# EasyEDA Pro project Control.eprj

# Schematic Schematic1
Board Name: Board1; Create Date: 2024-10-12
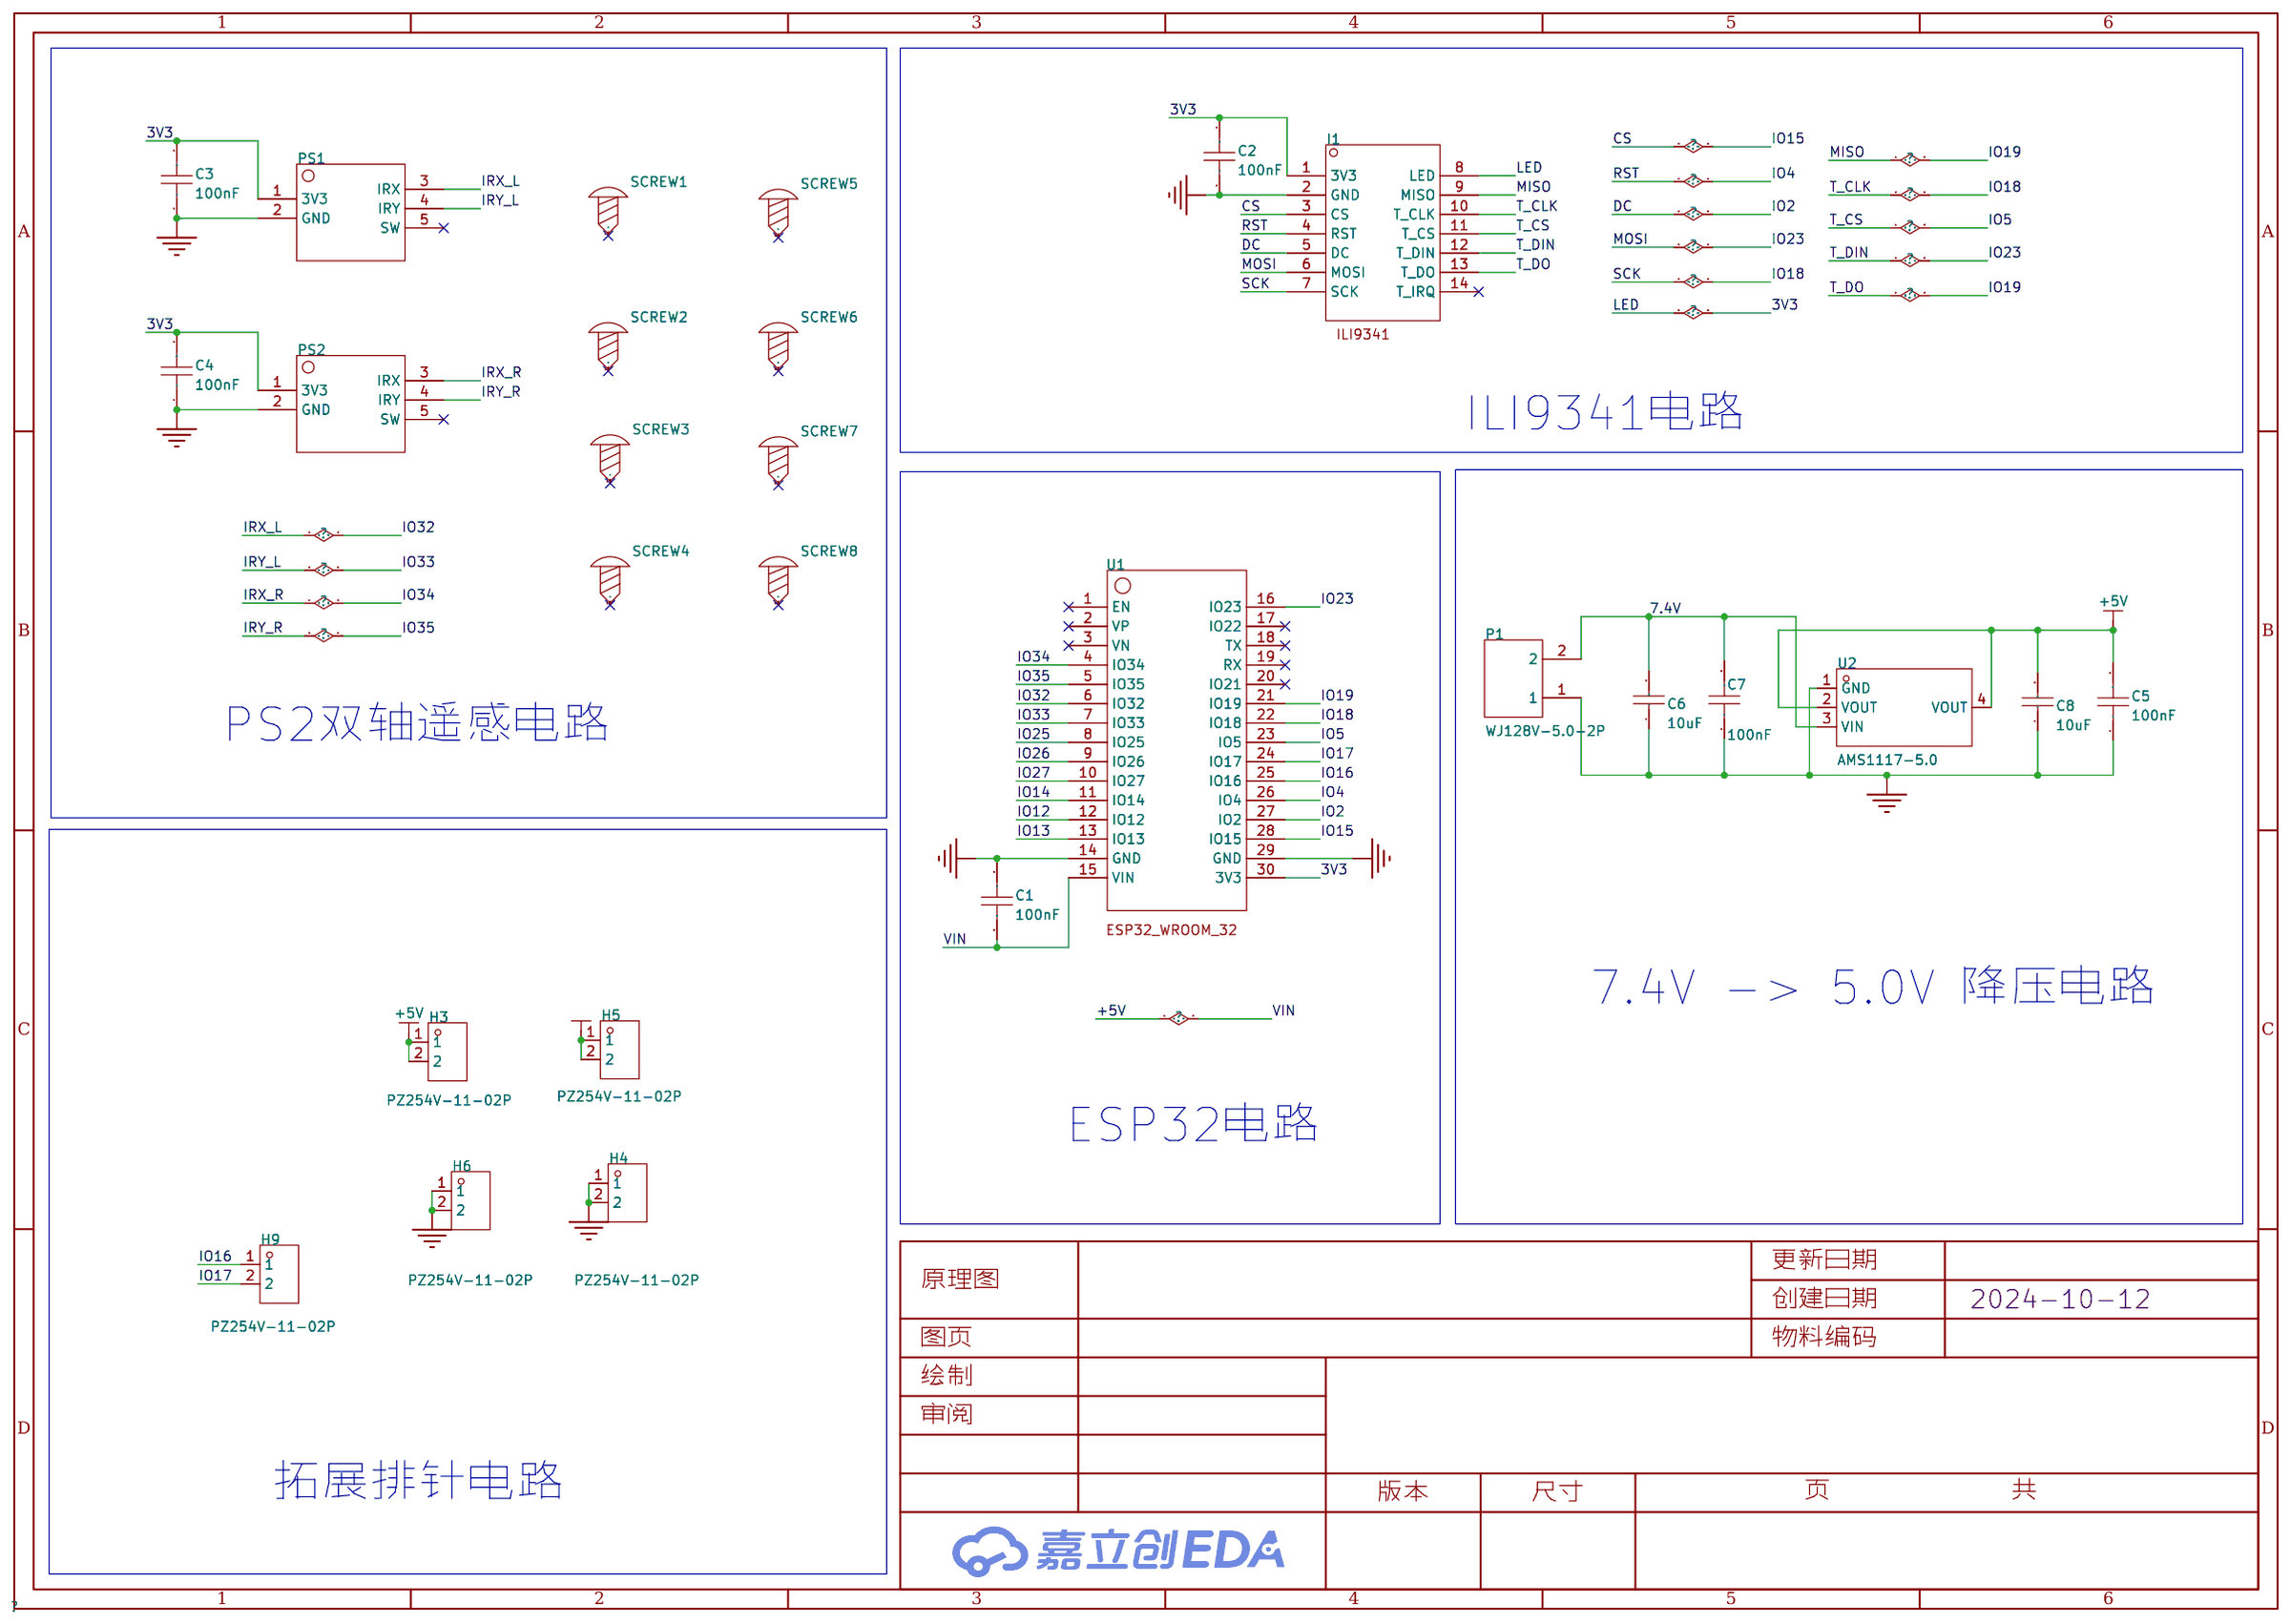
[diagram p0: schematic sheet]

## Parts
C1  100nF  [C0603]
C2  100nF  [C0603]
C3  100nF  [C0603]
C4  100nF  [C0603]
C5  100nF  [C0603]
C6  10uF  [C0805]
C7  100nF  [C0603]
C8  10uF  [C0805]
H3  PZ254V-11-02P  [HDR-TH_2P-P2.54-V-M]
H4  PZ254V-11-02P  [HDR-TH_2P-P2.54-V-M]
H5  PZ254V-11-02P  [HDR-TH_2P-P2.54-V-M]
H6  PZ254V-11-02P  [HDR-TH_2P-P2.54-V-M]
H9  PZ254V-11-02P  [HDR-TH_2P-P2.54-V-M]
I1  -  [ILI9341]
P1  WJ128V-5.0-2P  [CONN-TH_2P-P5.00_WJ128V-5.0-2P]
PS1  -  [PS2]
PS2  -  [PS2]
SCREW1  -  [M2螺丝]
SCREW2  -  [M2螺丝]
SCREW3  -  [M2螺丝]
SCREW4  -  [M2螺丝]
SCREW5  -  [M2螺丝]
SCREW6  -  [M2螺丝]
SCREW7  -  [M2螺丝]
SCREW8  -  [M2螺丝]
U1  -  [ESP32_WROOM_32]
U2  AMS1117-5.0  [SOT-223_L6.5-W3.5-P2.30-LS7.0-BR]

## Library data of the parts
C1-C5 C7 = CGA0603X7R104K500JT: 容值:100nF;精度:±10%;额定电压:50V;材质(温度系数):X7R;; LCSC Part Name: 100nF ±10% 50V; Supplier Part: C6119867; Manufacturer: HRE(芯声); Supplier Footprint: 0603; JLCPCB Part Class: 扩展库; Supplier: LCSC; Tolerance: ±10%; Voltage Rated: 50V; Temperature Coefficient: X7R
C6 C8 = CL21A106KPFNNNE: 容值:10uF;精度:±10%;额定电压:10V;材质(温度系数):X5R;; LCSC Part Name: 10uF ±10% 10V; Supplier Part: C17024; Manufacturer: SAMSUNG(三星); Supplier Footprint: 0805; JLCPCB Part Class: 扩展库; Datasheet: https://atta.szlcsc.com/upload/public/pdf/source/20160218/1457707763339.pdf; Supplier: LCSC; Tolerance: ±10%; Voltage Rated: 10V; Temperature Coefficient: X5R
H3-H6 H9 = PZ254V-11-02P: 插针结构:1x2P;间距:2.54mm;行距:-;圆针/方针:方针;安装类型:直插;排数:单排;总PIN位数:2P;额定电流:-;额定电压:-;配合针长度:6mm;塑高:2.5mm;端接针长度:3mm;触头材质:黄铜;触头镀层:-;工作温度范围:-40℃~+105℃;颜色:黑色;; LCSC Part Name: 间距:2.54mm 1x2P 直插 方针; Supplier Part: C492401; Manufacturer: XFCN(兴飞); Supplier Footprint: 插件,P=2.54mm; Datasheet: https://atta.szlcsc.com/upload/public/pdf/source/20200309/C492401_A812433581A9B211A7FFA413ADDFF0E5.pdf; Supplier: LCSC; Pin Structure: 1x2P; Pitch: 2.54mm; Circluar Pins/Square Pins: 方针; Mounting Type: 直插; Number of Rows: 单排; Number of Pins: 2P; Length of Mating Pin: 6mm; Insulation Height: 2.5mm; Length of End Connection Pin: 3mm; Contact Material: 黄铜; Operating Temperature Range: -40℃~+105℃; Color: 黑色
I1 = ILI9341
P1 = WJ128V-5.0-2P: 结构:1x2P;间距:5mm;颜色:绿色;安装方式:直插;额定电流:20A;额定电压:250V;排数:1;线规 - AWG:12~22;线规 - 平方毫米:2.5;每排PIN数:2;工作温度范围:-40℃~+105℃;; LCSC Part Name: 5mm 1x2P 排数:1 每排P数:2 直插; Supplier Part: C8269; Manufacturer: KANGNEX(康奈克斯电气); Supplier Footprint: 插件,P=5mm; Datasheet: https://atta.szlcsc.com/upload/public/pdf/source/20191225/C8269_1FF44D6D2E83DB14A7CA266A410FD9AD.pdf; Supplier: LCSC; Structure: 1x2P; Pitch: 5mm; Color: 绿色; Mounting Style: 直插; Current Rating (Max): 20A; Voltage Rating (Max): 250V; Number of Pins: 2P; Number of Rows: 1; Wire Gauge - AWG: 12~22; Wire Gauge - mm2: 2.5; Number of PINs Per Row: 2; Operating Temperature Range: -40℃~+105℃
PS1 PS2 = PS2
SCREW1-SCREW8 = M2螺丝: Supplier Footprint: 插件
U1 = ESP32_WROOM_32
U2 = AMS1117-5.0_C6187: 输出类型:固定;最大输入电压:12V;输出电压:5V;最大输出电流:1A;电源纹波抑制比(PSRR):68dB@(120Hz);输出极性:正极;; LCSC Part Name: 输入12V 输出5V 1A; Supplier Part: C6187; Manufacturer: AMS; Supplier Footprint: SOT-223; Datasheet: https://atta.szlcsc.com/upload/public/pdf/source/20230918/E4B716057EE82179D88E8A0894830D59.pdf; Supplier: LCSC; Output Type: 固定; Maximum Input Voltage: 12V; Output Voltage: 5V; MAX Output Current: 1A; Power Supply Rejection Ratio (PSRR): 68dB@(120Hz); Dropout Voltage: 1.3V@(1A); Output Polarity: 正极; Number of Outputs: 1

## Nets
3V3: C2.2 C3.2 C4.2 H5.1 H5.2 I1.1(3V3) I1.8(LED) PS1.1(3V3) PS2.1(3V3) U1.30(3V3)
7.4V: C6.2 C7.2 P1.2 U2.3(VIN)
+5V: C1.1 C5.2 C8.2 H3.1 H3.2 U1.15(VIN) U2.2(VOUT) U2.4(VOUT)
GND: C1.2 C2.1 C3.1 C4.1 C5.1 C6.1 C7.1 C8.1 H4.1 H4.2 H6.1 H6.2 I1.2(GND) P1.1 PS1.2(GND) PS2.2(GND) U1.14(GND) U1.29(GND) U2.1(GND)
CS: I1.3(CS) U1.28(IO15)
DC: I1.5(DC) U1.27(IO2)
IO4: I1.4(RST) U1.26(IO4)
IO5: I1.11(T_CS) U1.23(IO5)
IO12: U1.12(IO12)
IO13: U1.13(IO13)
IO14: U1.11(IO14)
IO16: H9.1 U1.25(IO16)
IO17: H9.2 U1.24(IO17)
IO18: I1.7(SCK) I1.10(T_CLK) U1.22(IO18)
IO19: I1.9(MISO) I1.13(T_DO) U1.21(IO19)
IO23: I1.6(MOSI) I1.12(T_DIN) U1.16(IO23)
IO25: U1.8(IO25)
IO26: U1.9(IO26)
IO27: U1.10(IO27)
IO32: PS1.3(IRX) U1.6(IO32)
IO33: PS1.4(IRY) U1.7(IO33)
IO34: PS2.3(IRX) U1.4(IO34)
IO35: PS2.4(IRY) U1.5(IO35)

Not connected (* = marked no-connect by the designer): I1 14(T_IRQ)*; PS1 5(SW)*; PS2 5(SW)*; SCREW1 1*; SCREW2 1*; SCREW3 1*; SCREW4 1*; SCREW5 1*; SCREW6 1*; SCREW7 1*; SCREW8 1*; U1 1(EN)* 2(VP)* 3(VN)* 17(IO22)* 18(TX)* 19(RX)* 20(IO21)*

## Notes on the sheet
- ILI9341电路
- PS2双轴遥感电路
- 7.4V -> 5.0V 降压电路
- ESP32电路
- 拓展排针电路

# Board PCB1
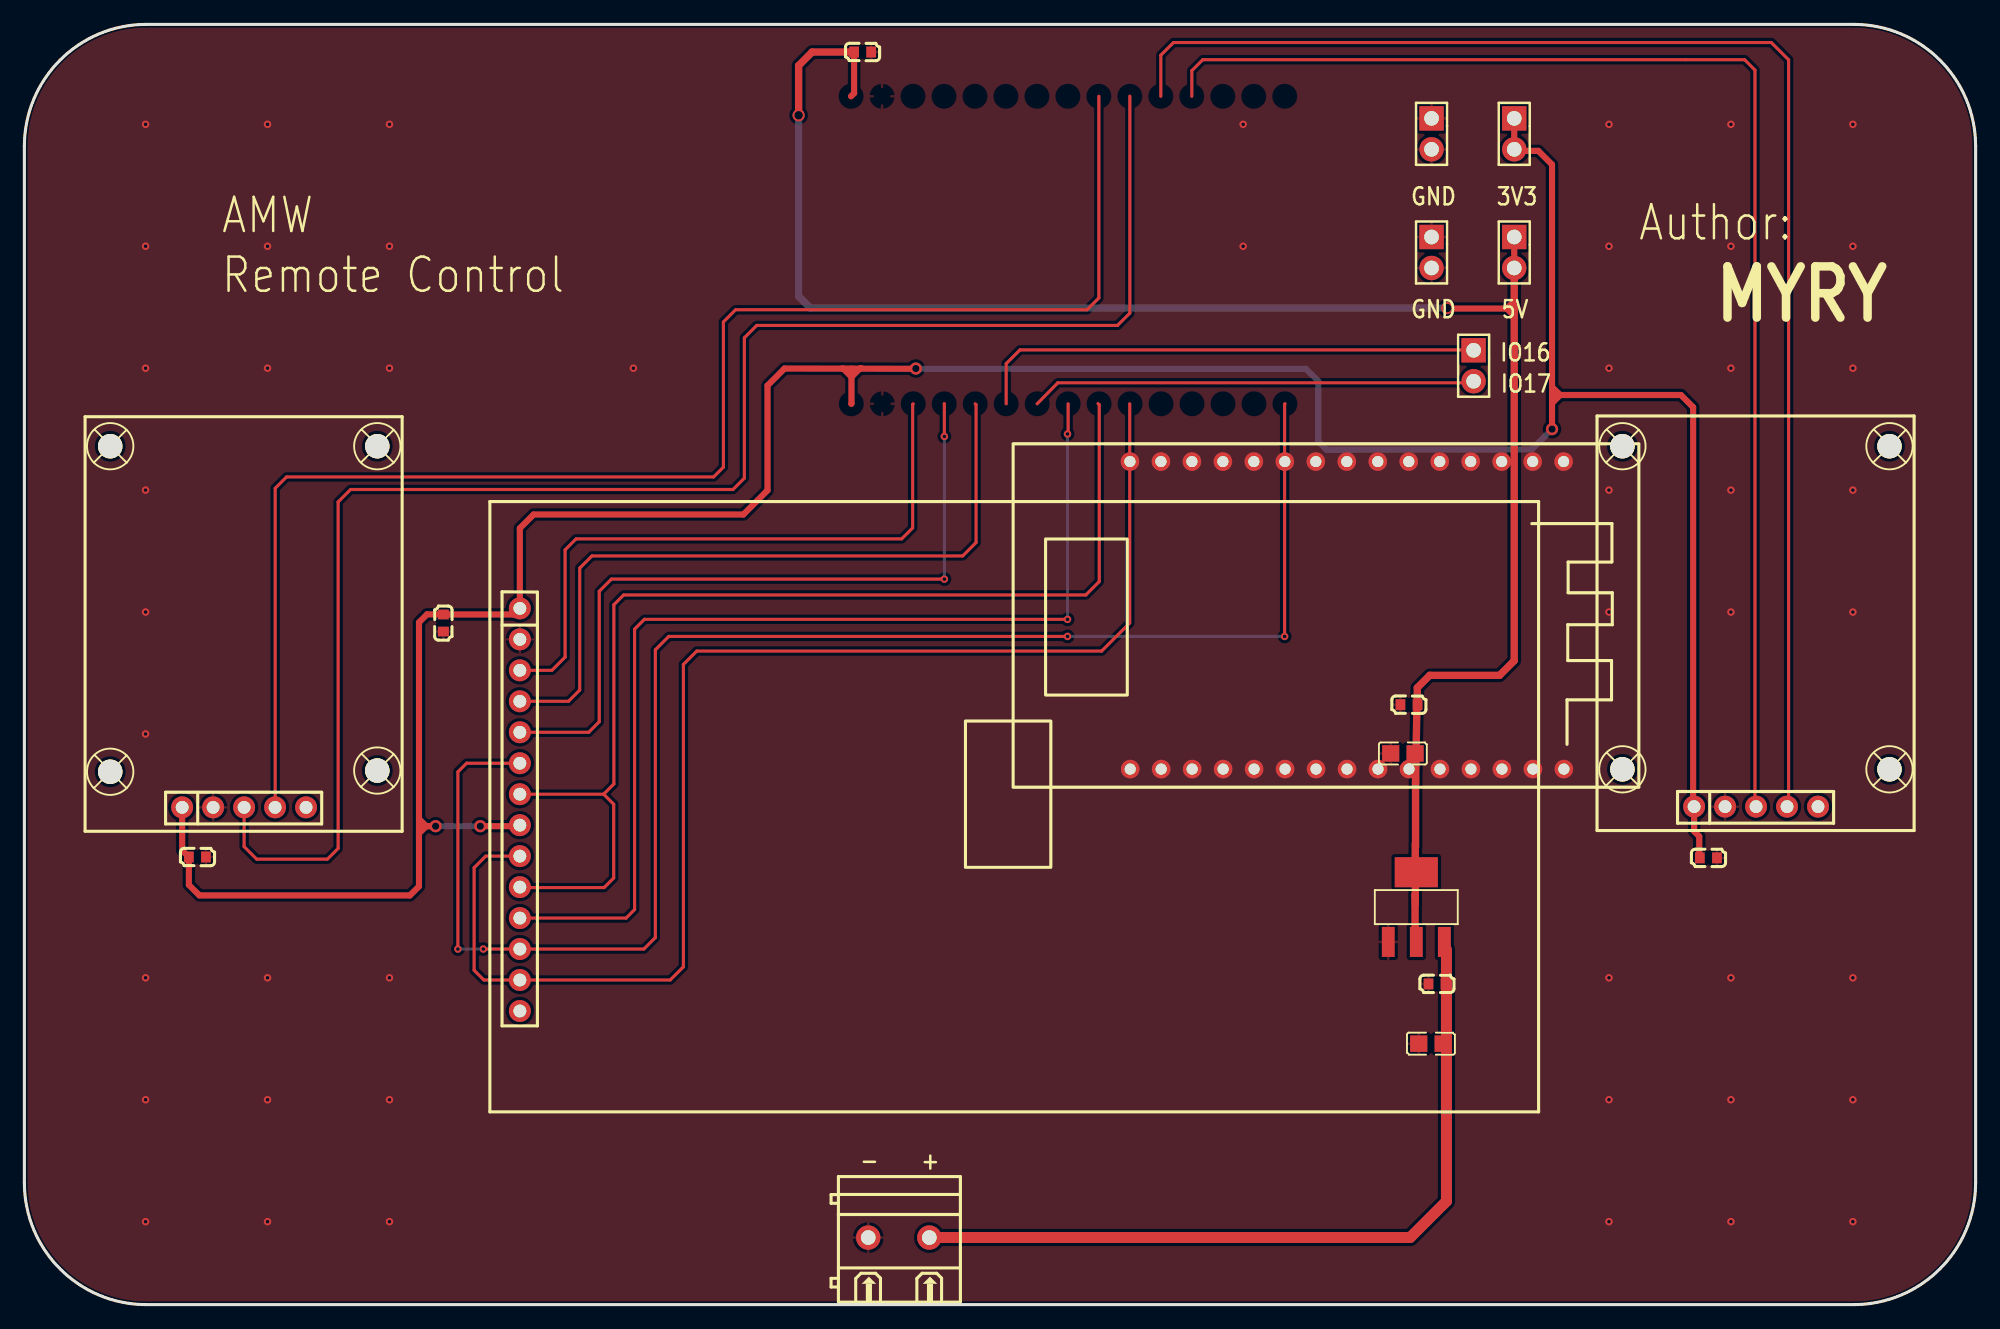
[diagram p1: board, top side]
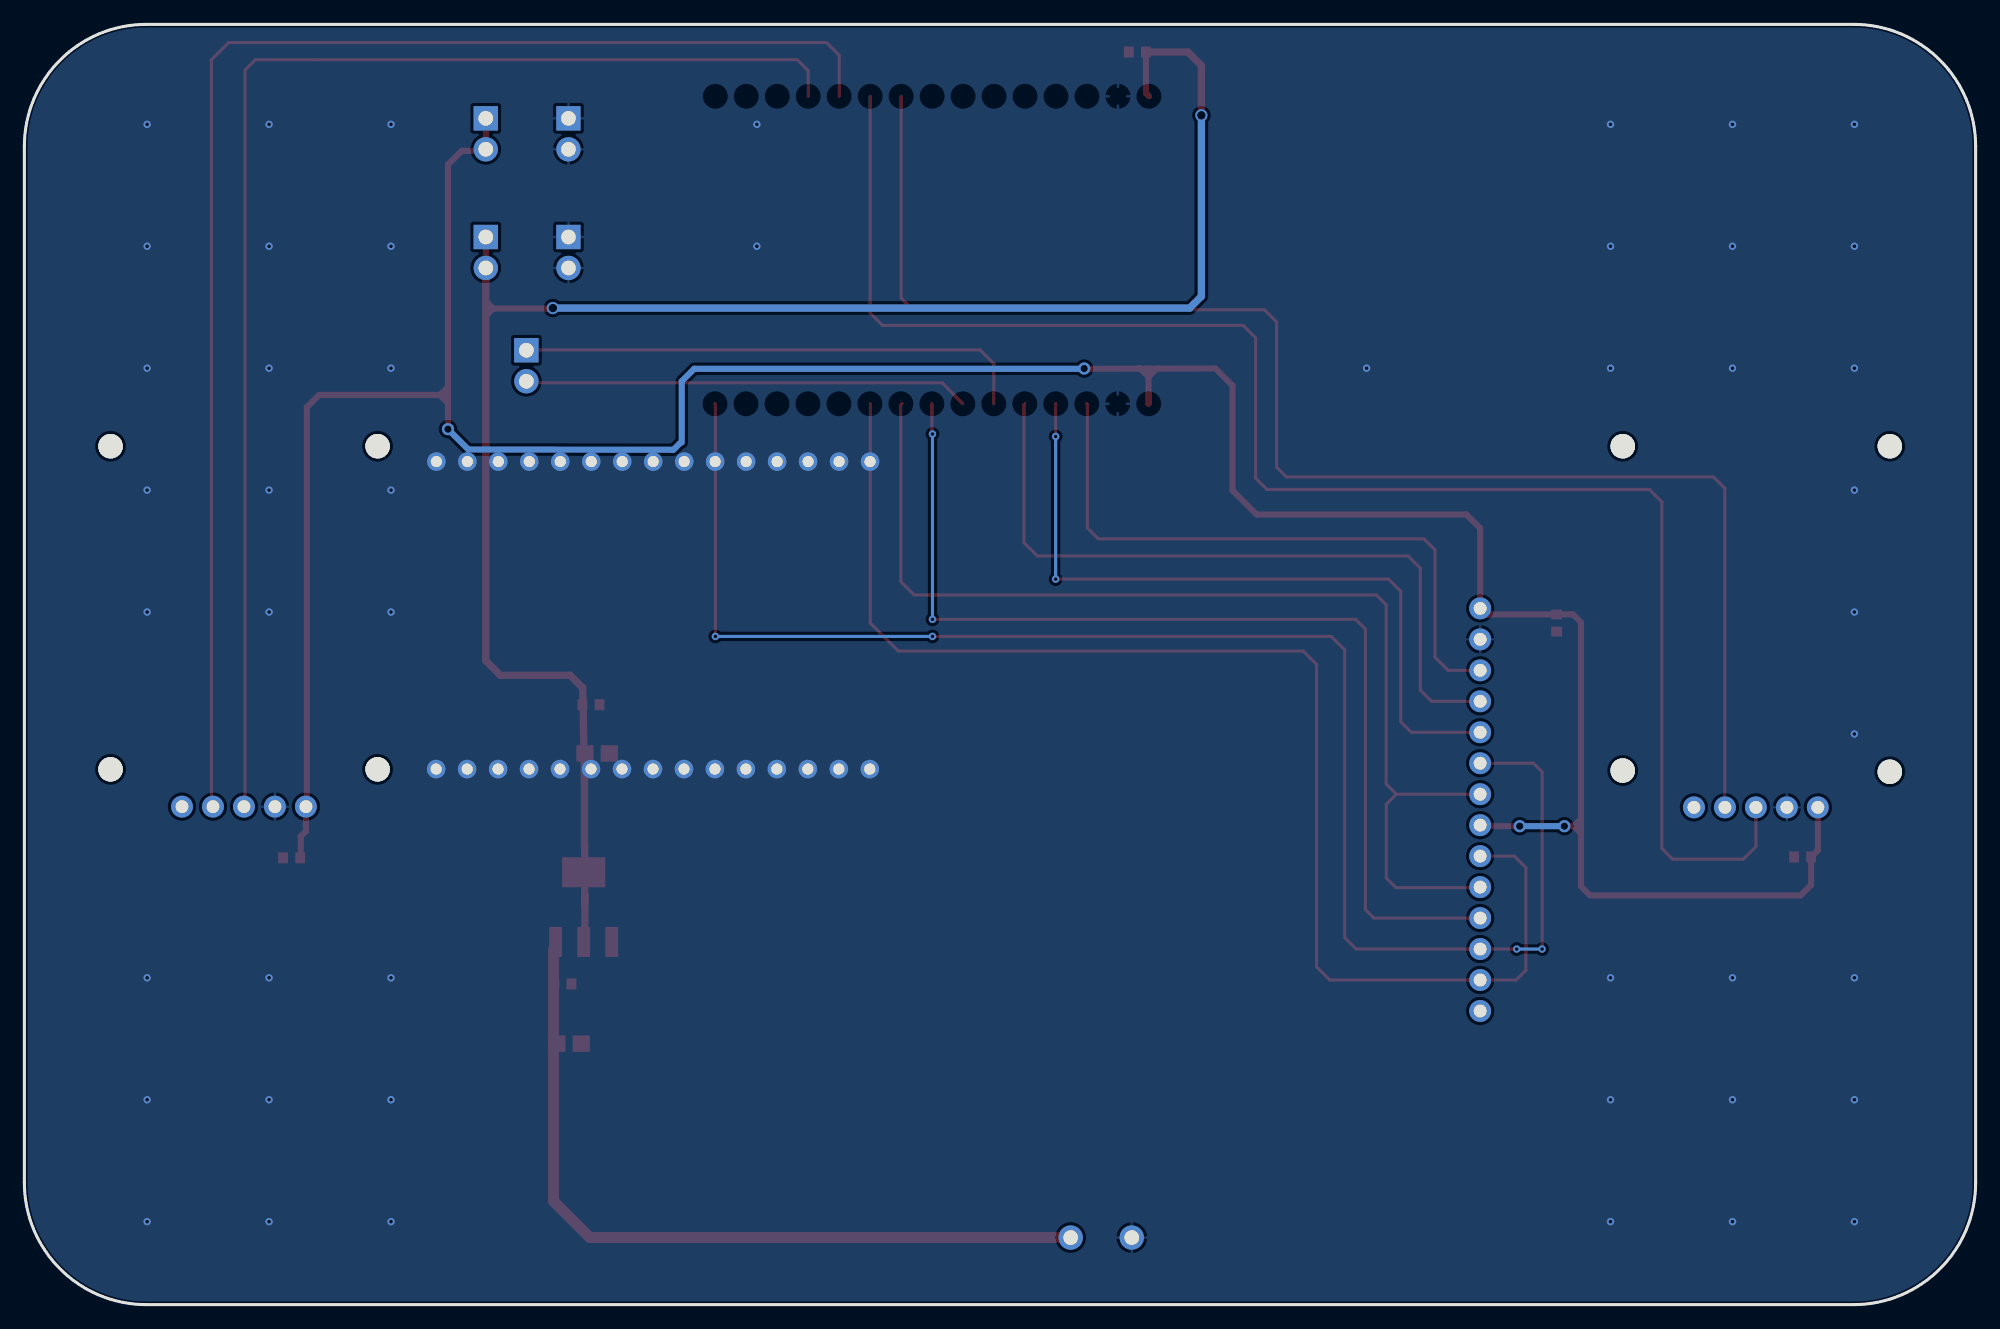
[diagram p2: board, bottom side, seen from below]

Outline 160 x 105 mm; copper layers: Top Layer, Bottom Layer. Coordinates in mm from the lower left corner of the outline.
Outline path: 0,95 0,10 arc(2.93,2.93) 10,0 150,0 arc(157.07,2.93) 160,10 160,95 arc(157.07,102.07) 150,105 10,105 arc(2.93,102.07) 0,95
Stack: Top Layer 0.035mm / Dielectric1 1.51mm FR4 er 4.5 / Bottom Layer 0.035mm

## Design rules (mm)
template: JLCPCB Capability(Two Layers Board)
spacing copperThickness1oz (default): track to track 0.102, other pairs 0.152 to 0.3
spacing copperThickness2oz: track to track 0.203, other pairs 0.152 to 0.3
track width copperThickness1oz (default): min 0.127, default 0.254, max 2.54
track width copperThickness2oz: min 0.203, default 0.254, max 2.54
differential pair differentialPair (default): width min 0.127, default 0.254, max 2.54; gap min 0.152, default 0.152
via viaSize (default): diameter min 0.5, default 0.61, max 10; hole min 0.3, default 0.305, max 6.3

## Placement (name value [footprint] x y rotation side)
C1  100nF  [C0603]  68.74 102.73 0 top
C2  100nF  [C0603]  34.36 55.9 90 top
C3  100nF  [C0603]  138.09 36.64 180 top
C4  100nF  [C0603]  14.19 36.71 180 top
C5  100nF  [C0603]  113.54 49.2 0 top
C6  10uF  [C0805]  115.34 21.4 0 top
C7  100nF  [C0603]  115.84 26.3 0 top
C8  10uF  [C0805]  113.04 45.2 0 top
H3  PZ254V-11-02P  [HDR-TH_2P-P2.54-V-M]  122.17 86.29 270 top
H4  PZ254V-11-02P  [HDR-TH_2P-P2.54-V-M]  115.39 96.02 270 top
H5  PZ254V-11-02P  [HDR-TH_2P-P2.54-V-M]  122.17 96.02 270 top
H6  PZ254V-11-02P  [HDR-TH_2P-P2.54-V-M]  115.39 86.29 270 top
H9  PZ254V-11-02P  [HDR-TH_2P-P2.54-V-M]  118.84 77 270 top
I1  -  [ILI9341]  69.17 41.86 270 top
P1  WJ128V-5.0-2P  [CONN-TH_2P-P5.00_WJ128V-5.0-2P]  71.7 5.5 0 top
PS1  -  [PS2]  13.98 56.82 0 top
PS2  -  [PS2]  137.96 56.88 0 top
SCREW1  -  [M2螺丝]  7.04 70.4 0 top
SCREW2  -  [M2螺丝]  28.94 70.4 0 top
SCREW3  -  [M2螺丝]  7.04 43.7 0 top
SCREW4  -  [M2螺丝]  28.94 43.8 0 top
SCREW5  -  [M2螺丝]  131.04 70.4 0 top
SCREW6  -  [M2螺丝]  152.94 70.4 0 top
SCREW7  -  [M2螺丝]  131.04 43.9 0 top
SCREW8  -  [M2螺丝]  152.94 43.9 0 top
U1  -  [ESP32_WROOM_32]  98.29 73.88 270 top
U2  AMS1117-5.0  [SOT-223_L6.5-W3.5-P2.30-LS7.0-BR]  114.14 32.6 270 top

## Footprints (pads in the part's own frame, mm; a bottom-side part is the same pattern mirrored in y, then rotated)
C0603
  rect 0.8x0.9 smd: 1(-0.7,0) 2(0.7,0)
C0805
  rect 1.41x1.35 smd: 1(-1,0) 2(1,0)
CONN-TH_2P-P5.00_WJ128V-5.0-2P
  round 2 hole 1.2: 1(-2.505,0) 2(2.505,0)
ESP32_WROOM_32
  round 1.524 hole 0.914: 1(4.74,27.93) 2(4.74,25.39) 3(4.74,22.85) 4(4.74,20.31) 5(4.74,17.77) 6(4.74,15.23) 7(4.74,12.69) 8(4.74,10.15) 9(4.74,7.61) 10(4.74,5.07) 11(4.74,2.53) 12(4.74,-0.01) 13(4.74,-2.55) 14(4.74,-5.09) 15(4.74,-7.63) 16(29.96,27.95) 17(29.96,25.41) 18(29.96,22.87) 19(29.96,20.33) 20(29.96,17.79) 21(29.96,15.25) 22(29.96,12.71) 23(29.96,10.17) 24(29.96,7.63) 25(29.96,5.09) 26(29.96,2.55) 27(29.96,0.01) 28(29.96,-2.53) 29(29.96,-5.07) 30(29.96,-7.61)
HDR-TH_2P-P2.54-V-M
  rect 2x2 hole 1.2: 1(-1.27,0)
  round 2 hole 1.2: 2(1.27,0)
ILI9341
  round 1.8 hole 1.05: 1(-15.24,-28.54) 2(-12.7,-28.54) 3(-10.16,-28.54) 4(-7.62,-28.54) 5(-5.08,-28.54) 6(-2.54,-28.54) 7(0,-28.54) 8(2.54,-28.54) 9(5.08,-28.54) 10(7.62,-28.54) 11(10.16,-28.54) 12(12.7,-28.54) 13(15.24,-28.54) 14(17.78,-28.54)
M2螺丝
  round 2 hole 2: 1(0,0)
PS2
  round 1.8 hole 1.05: 1(-1.04,-16.04) 2(1.5,-16.04) 3(4.04,-16.04) 4(6.58,-16.04) 5(9.12,-16.04)
SOT-223_L6.5-W3.5-P2.30-LS7.0-BR
  rect 2.465x1.05 smd: 1(2.857,-2.3) 2(2.857,0) 3(2.857,2.3)
  rect 2.465x3.54 smd: 4(-2.857,0)

## Nets
As in the schematic.

Pads without a net: I1 14; PS1 5; PS2 5; SCREW1 1; SCREW2 1; SCREW3 1; SCREW4 1; SCREW5 1; SCREW6 1; SCREW7 1; SCREW8 1; U1 1 2 3 17 18 19 20

## Via types
v1: diameter 0.61, hole 0.305, Top Layer to Bottom Layer, 56 vias
v2: diameter 1, hole 0.7, Top Layer to Bottom Layer, 2 vias
v3: diameter 1, hole 0.6, Top Layer to Bottom Layer, 4 vias

## Routing (per net, layer and track width the routed paths; a pad name or vN(x,y) marks a point on that pad's centre or on a via; arc(x,y) is an arc through that point)
3V3: length 259.1
  Top Layer w0.5: PS1.1 12.94,37.26 C4.2 13.49,34.42 14.35,33.56 31.62,33.56 32.36,34.3 32.36,55.95 33.02,56.61 34.35,56.61 C2.2 40.13,56.6 I1.1 40.63,63.67 41.76,64.8 58.96,64.8 60.94,66.78 60.94,75.38 62.33,76.77 73.17,76.75 73.14,76.7 ; 32.36,39.24 v3(33.72,39.24) ; v3(33.72,39.24) 32.95,39.24 ; v3(33.72,39.24) 33.75,39.21 ; 32.36,38.58 32.36,38.65 32.95,39.24 ; 32.95,39.24 32.36,39.83 ; v3(37.38,39.24) 40.54,39.24 I1.8 ; 67.01,76.77 67.13,76.77 67.82,76.09 68.54,76.8 68.64,76.8 ; 67.82,76.77 67.82,73.9 67.81,73.88 ; H5.1 H5.2 ; 122.17,94.63 124.14,94.63 125.27,93.5 v3(125.27,71.8) ; 125.27,75.25 125.84,74.7 ; 125.33,74.6 135.84,74.6 136.84,73.6 136.84,40.92 PS2.1 136.92,38.82 137.34,38.4 137.34,36.69 C3.2 ; 125.94,74.6 125.34,74
  Bottom Layer w0.5: v3(33.72,39.24) v3(37.38,39.24) 37.39,39.24 ; 73.07,76.75 105.08,76.75 106.1,75.73 106.1,70.71 ; 106.23,70.66 106.78,70.11 106.88,70.11 123.59,70.13 v3(125.27,71.8)
  vias: v3(73.1,76.77)
+5V: length 154.3
  Top Layer w0.5: C1.1 68.04,99.35 67.79,99.1 ; 116.71,81.69 122.1,81.69 122.16,81.75 ; 122.13,82.18 122.05,82.18 121.56,81.69 122.08,81.17 122.12,81.17 ; H3.2 H3.1
  Top Layer w0.6: v2(63.49,97.54) 63.49,101.62 64.6,102.73 C1.1 ; 114.03,33.63 114.04,33.5 114.04,29.82 ; 114.05,32.8 114.05,37.8 ; 114.08,42.73 114.2,49.91 ; 114.08,37.52 114.08,43.23 ; 114.22,49.91 114.22,50.59 115.24,51.61 120.97,51.61 122.17,52.81 H3.2
  Bottom Layer w0.6: v2(63.49,97.54) 63.49,82.69 64.45,81.73 v2(116.67,81.73) 116.71,81.69
GND:
  vias: v1(9.94,96.8) v1(9.94,86.8) v1(9.94,76.8) v1(9.94,66.8) v1(9.94,56.8) v1(9.94,46.8) v1(9.94,26.8) v1(9.94,16.8) v1(9.94,6.8) v1(19.94,96.8) v1(19.94,86.8) v1(19.94,76.8) v1(19.94,26.8) v1(19.94,16.8) v1(19.94,6.8) v1(29.94,96.8) v1(29.94,86.8) v1(29.94,76.8) v1(29.94,26.8) v1(29.94,16.8) v1(29.94,6.8) v1(49.94,76.8) v1(99.94,96.8) v1(99.94,86.8) v1(129.94,96.8) v1(129.94,86.8) v1(129.94,76.8) v1(129.94,66.8) v1(129.94,56.8) v1(129.94,26.8) v1(129.94,16.8) v1(129.94,6.8) v1(139.94,96.8) v1(139.94,86.8) v1(139.94,76.8) v1(139.94,66.8) v1(139.94,56.8) v1(139.94,26.8) v1(139.94,16.8) v1(139.94,6.8) v1(149.94,96.8) v1(149.94,86.8) v1(149.94,76.8) v1(149.94,66.8) v1(149.94,56.8) v1(149.94,26.8) v1(149.94,16.8) v1(149.94,6.8)
DC: length 60.7
  Top Layer w0.254: I1.5 46.28,46.94 47.14,47.8 47.14,58.5 48.14,59.5 v1(75.44,59.5) ; 75.43,73.88 75.44,73.87 v1(75.44,71.2)
  Bottom Layer w0.254: v1(75.44,59.5) v1(75.44,71.2)
IO5: length 86.2
  Top Layer w0.254: I1.11 49.34,31.7 50.04,32.4 50.04,55.4 50.84,56.2 v1(85.54,56.2) ; v1(85.54,71.4) 85.59,71.45 85.59,73.88
  Bottom Layer w0.254: v1(85.54,56.2) v1(85.54,71.4)
IO23: length 131.2
  Top Layer w0.254: v1(35.55,29.16) 35.55,43.69 36.26,44.4 I1.6 ; v1(37.63,29.16) I1.12 50.8,29.16 51.74,30.1 51.74,53.7 52.84,54.8 v1(85.54,54.8) ; 103.37,73.88 103.34,73.85 v1(103.34,54.8)
  Bottom Layer w0.254: v1(35.55,29.16) v1(37.63,29.16) ; v1(85.54,54.8) v1(103.34,54.8)
7.4V: length 64.3
  Top Layer w0.9: P1.2 74.21,5.5 113.64,5.5 116.61,8.47 116.61,29.12
CS: length 52.4
  Top Layer w0.254: I1.3 43.26,52.02 44.34,53.1 44.34,61.9 45.24,62.8 71.94,62.8 72.84,63.7 72.84,73.83 72.89,73.88
IO4: length 60.1
  Top Layer w0.254: I1.4 44.62,49.48 45.54,50.4 45.54,60.4 46.54,61.4 76.94,61.4 78.04,62.5 78.04,73.81 77.97,73.88
IO16: length 42.1
  Top Layer w0.254: 80.51,73.88 80.51,77.17 81.64,78.3 118.81,78.3 H9.1
IO17: length 36.6
  Top Layer w0.254: 83.05,73.88 84.74,75.6 118.91,75.6 118.94,75.63
IO18: length 93.2
  Top Layer w0.254: I1.7 47.5,41.86 ; 47.5,41.86 48.32,41.04 48.32,34.99 47.54,34.2 40.67,34.2 I1.10 ; 47.5,41.86 48.34,42.7 48.34,57.4 49.14,58.2 87.04,58.2 88.14,59.3 88.14,73.8 88.04,73.9
IO19: length 111.3
  Top Layer w0.254: I1.9 37.83,36.78 36.88,35.83 36.88,27.42 37.68,26.62 I1.13 52.96,26.62 54.04,27.7 54.04,52.5 55.14,53.6 88.34,53.6 90.64,55.9 90.64,73.88
IO32: length 136
  Top Layer w0.254: 18.02,40.79 18.02,37.56 19.05,36.53 24.85,36.53 25.73,37.41 25.73,65.83 26.75,66.85 58.11,66.85 59.04,67.78 59.04,79.29 60.06,80.31 89.64,80.31 90.65,81.32 90.65,99.11
IO33: length 123.7
  Top Layer w0.254: PS1.4 20.57,40.79 20.57,66.95 21.5,67.88 56.52,67.88 57.32,68.68 57.32,80.59 58.32,81.59 87.14,81.59 88.11,82.56 88.11,99.1
IO34: length 109.5
  Top Layer w0.254: 95.73,99.1 95.73,101.2 96.63,102.1 141.06,102.1 141.91,101.25 141.91,40.93 PS2.3
IO35: length 117.2
  Top Layer w0.254: 93.19,99.1 93.19,102.47 94.23,103.51 143.25,103.51 144.67,102.09 144.67,40.97 PS2.4

## Copper pours and planes (outline as drawn; the poured copper is in the pictures)
GND on Top Layer: -6.16,108.7 163.64,108.7 163.64,-9.1 -6.16,-9.1
GND on Bottom Layer: -9.66,121.4 176.34,121.4 176.34,-9.3 -9.66,-9.3

## Text on the board
Top Silkscreen Layer: - | + | GND | 3V3 | IO16 | IO17 | 5V | AMW | Remote Control | Author: | MYRY
